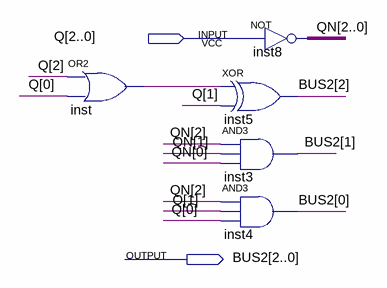
[diagram p0: schematic sheet]
// Quartus schematic BUS2.bdf as structural Verilog: 5 symbols, 2 pins
module BUS2 (
  input  [2:0] Q,
  output [2:0] BUS2
);

  wire inst_out;
  wire [2:0] QN;

  or inst (inst_out, Q[2], Q[0]);
  xor inst5 (BUS2[2], inst_out, Q[1]);
  and inst3 (BUS2[1], QN[2], QN[1], QN[0]);
  and inst4 (BUS2[0], QN[2], Q[1], Q[0]);
  assign QN = ~Q;  // NOT inst8, 3 bits wide
endmodule
